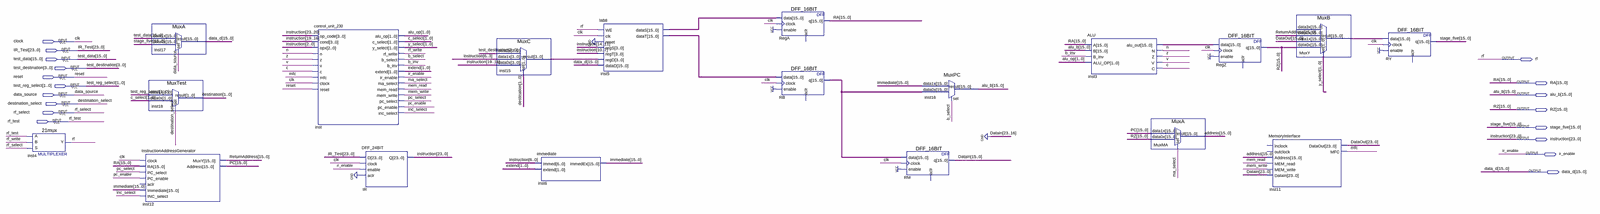
[diagram p0: schematic sheet, whole]
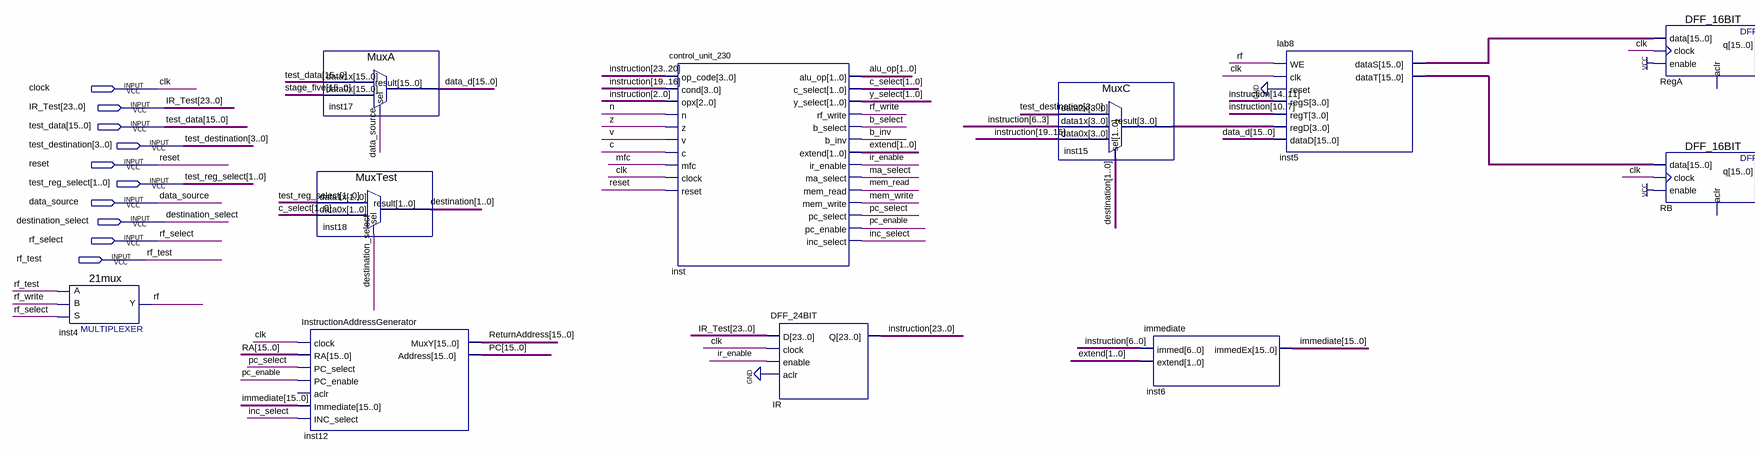
[diagram p1: schematic sheet, left part]
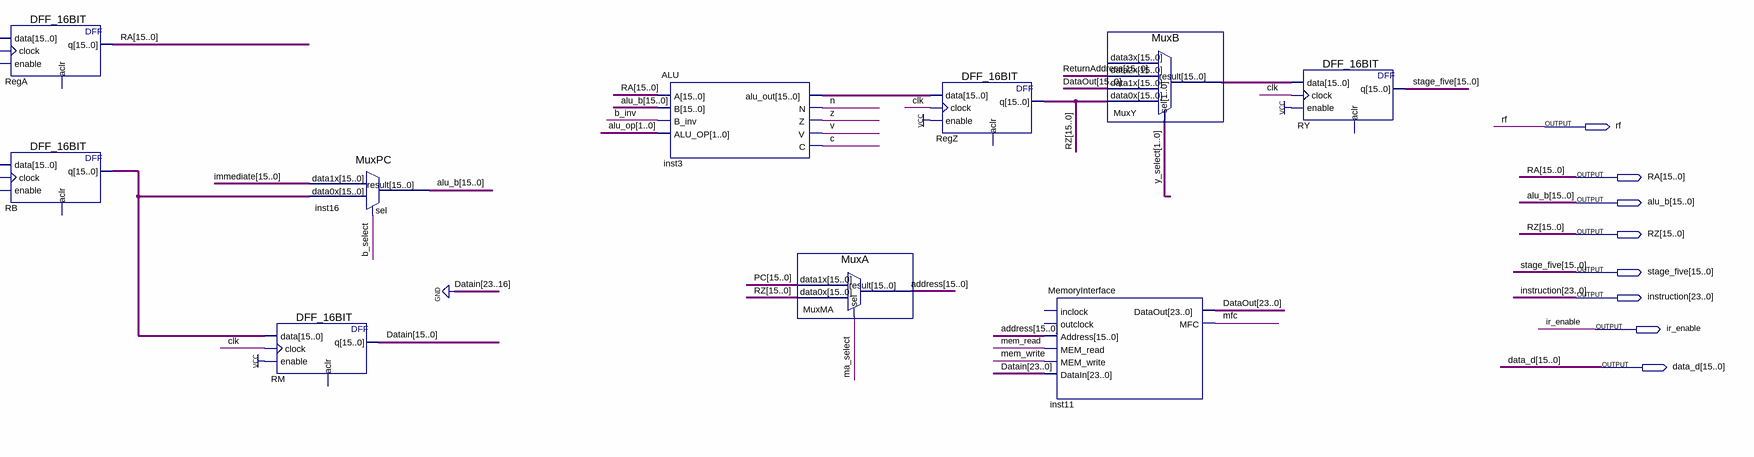
[diagram p2: schematic sheet, right part]
// Quartus schematic datapath.bdf as structural Verilog: 19 symbols, 18 pins
module datapath (
  input  clock,
  input  [23:0] IR_Test,
  input  [15:0] test_data,
  input  [3:0] test_destination,
  input  reset,
  input  [1:0] test_reg_select,
  input  data_source,
  input  destination_select,
  input  rf_select,
  input  rf_test,
  output rf,
  output [15:0] RA,
  output [15:0] alu_b,
  output [15:0] RZ,
  output [15:0] stage_five,
  output [23:0] instruction,
  output ir_enable,
  output [15:0] data_d
);

  wire b_inv, b_select, c, inc_select, ma_select, mem_read, mem_write, mfc, n, pc_enable, pc_select,
       rf_write, v, z;
  wire [1:0] alu_op, c_select, destination, extend, y_select;
  wire [3:0] inst15_result;
  wire [15:0] address, Datain, immediate, inst3_alu_out, inst5_datas, inst5_datat, MuxY_result, PC, RB_q,
       ReturnAddress;
  wire [23:0] DataOut;

  \21mux  inst4 (.S(rf_select), .B(rf_write), .A(rf_test), .Y(rf));
  MuxA inst17 (.data1x(test_data), .data0x(stage_five), .sel(data_source), .result(data_d));
  MuxTest inst18 (.data1x(test_reg_select), .data0x(c_select), .sel(destination_select), .result(destination));
  InstructionAddressGenerator inst12 (
    .clock(clock), .RA(RA), .PC_select(pc_select), .PC_enable(pc_enable), .Immediate(immediate),
    .INC_select(inc_select), .MuxY(ReturnAddress), .Address(PC));  // open: aclr
  control_unit_230 inst (
    .op_code(instruction[23:20]), .cond(instruction[19:16]), .opx(instruction[2:0]), .n(n), .z(z), .v(v),
    .c(c), .mfc(mfc), .clock(clock), .reset(reset), .alu_op(alu_op), .c_select(c_select),
    .y_select(y_select), .rf_write(rf_write), .b_select(b_select), .b_inv(b_inv), .extend(extend),
    .ir_enable(ir_enable), .ma_select(ma_select), .mem_read(mem_read), .mem_write(mem_write),
    .pc_select(pc_select), .pc_enable(pc_enable), .inc_select(inc_select));
  DFF_24BIT IR (.D(IR_Test), .clock(clock), .enable(ir_enable), .aclr(1'b0), .Q(instruction));
  MuxC inst15 (
    .data2x(test_destination), .data1x(instruction[6:3]), .data0x(instruction[19:16]), .sel(destination),
    .result(inst15_result));
  immediate inst6 (.immed(instruction[6:0]), .extend(extend), .immedEx(immediate));
  lab8 inst5 (
    .WE(rf), .clk(clock), .reset(1'b0), .regS(instruction[14:11]), .regT(instruction[10:7]),
    .regD(inst15_result), .dataD(data_d), .dataS(inst5_datas), .dataT(inst5_datat));
  DFF_16BIT RegA (.data(inst5_datas), .clock(clock), .enable(1'b1), .q(RA));  // open: aclr
  DFF_16BIT RB (.data(inst5_datat), .clock(clock), .enable(1'b1), .q(RB_q));  // open: aclr
  DFF_16BIT RM (.data(RB_q), .clock(clock), .enable(1'b1), .q(Datain));  // open: aclr
  MuxPC inst16 (.data1x(immediate), .data0x(RB_q), .sel(b_select), .result(alu_b));
  ALU inst3 (.A(RA), .B(alu_b), .B_inv(b_inv), .ALU_OP(alu_op), .alu_out(inst3_alu_out), .N(n), .Z(z), .V(v), .C(c));
  MuxA MuxMA (.data1x(PC), .data0x(RZ), .sel(ma_select), .result(address));
  DFF_16BIT RegZ (.data(inst3_alu_out), .clock(clock), .enable(1'b1), .q(RZ));  // open: aclr
  MemoryInterface inst11 (
    .Address(address), .MEM_read(mem_read), .MEM_write(mem_write), .DataIn({{8{1'b0}}, Datain}),
    .DataOut(DataOut), .MFC(mfc));  // open: inclock, outclock
  MuxB MuxY (
    .data2x(ReturnAddress), .data1x(DataOut[15:0]), .data0x(RZ), .sel(y_select), .result(MuxY_result));  // open: data3x
  DFF_16BIT RY (.data(MuxY_result), .clock(clock), .enable(1'b1), .q(stage_five));  // open: aclr

  // Other names for the same wires on the sheet: clk = clock
endmodule
